# EAGLE schematic Guitutar (EAGLE 8.0.0)

## Sheet 1 of 2
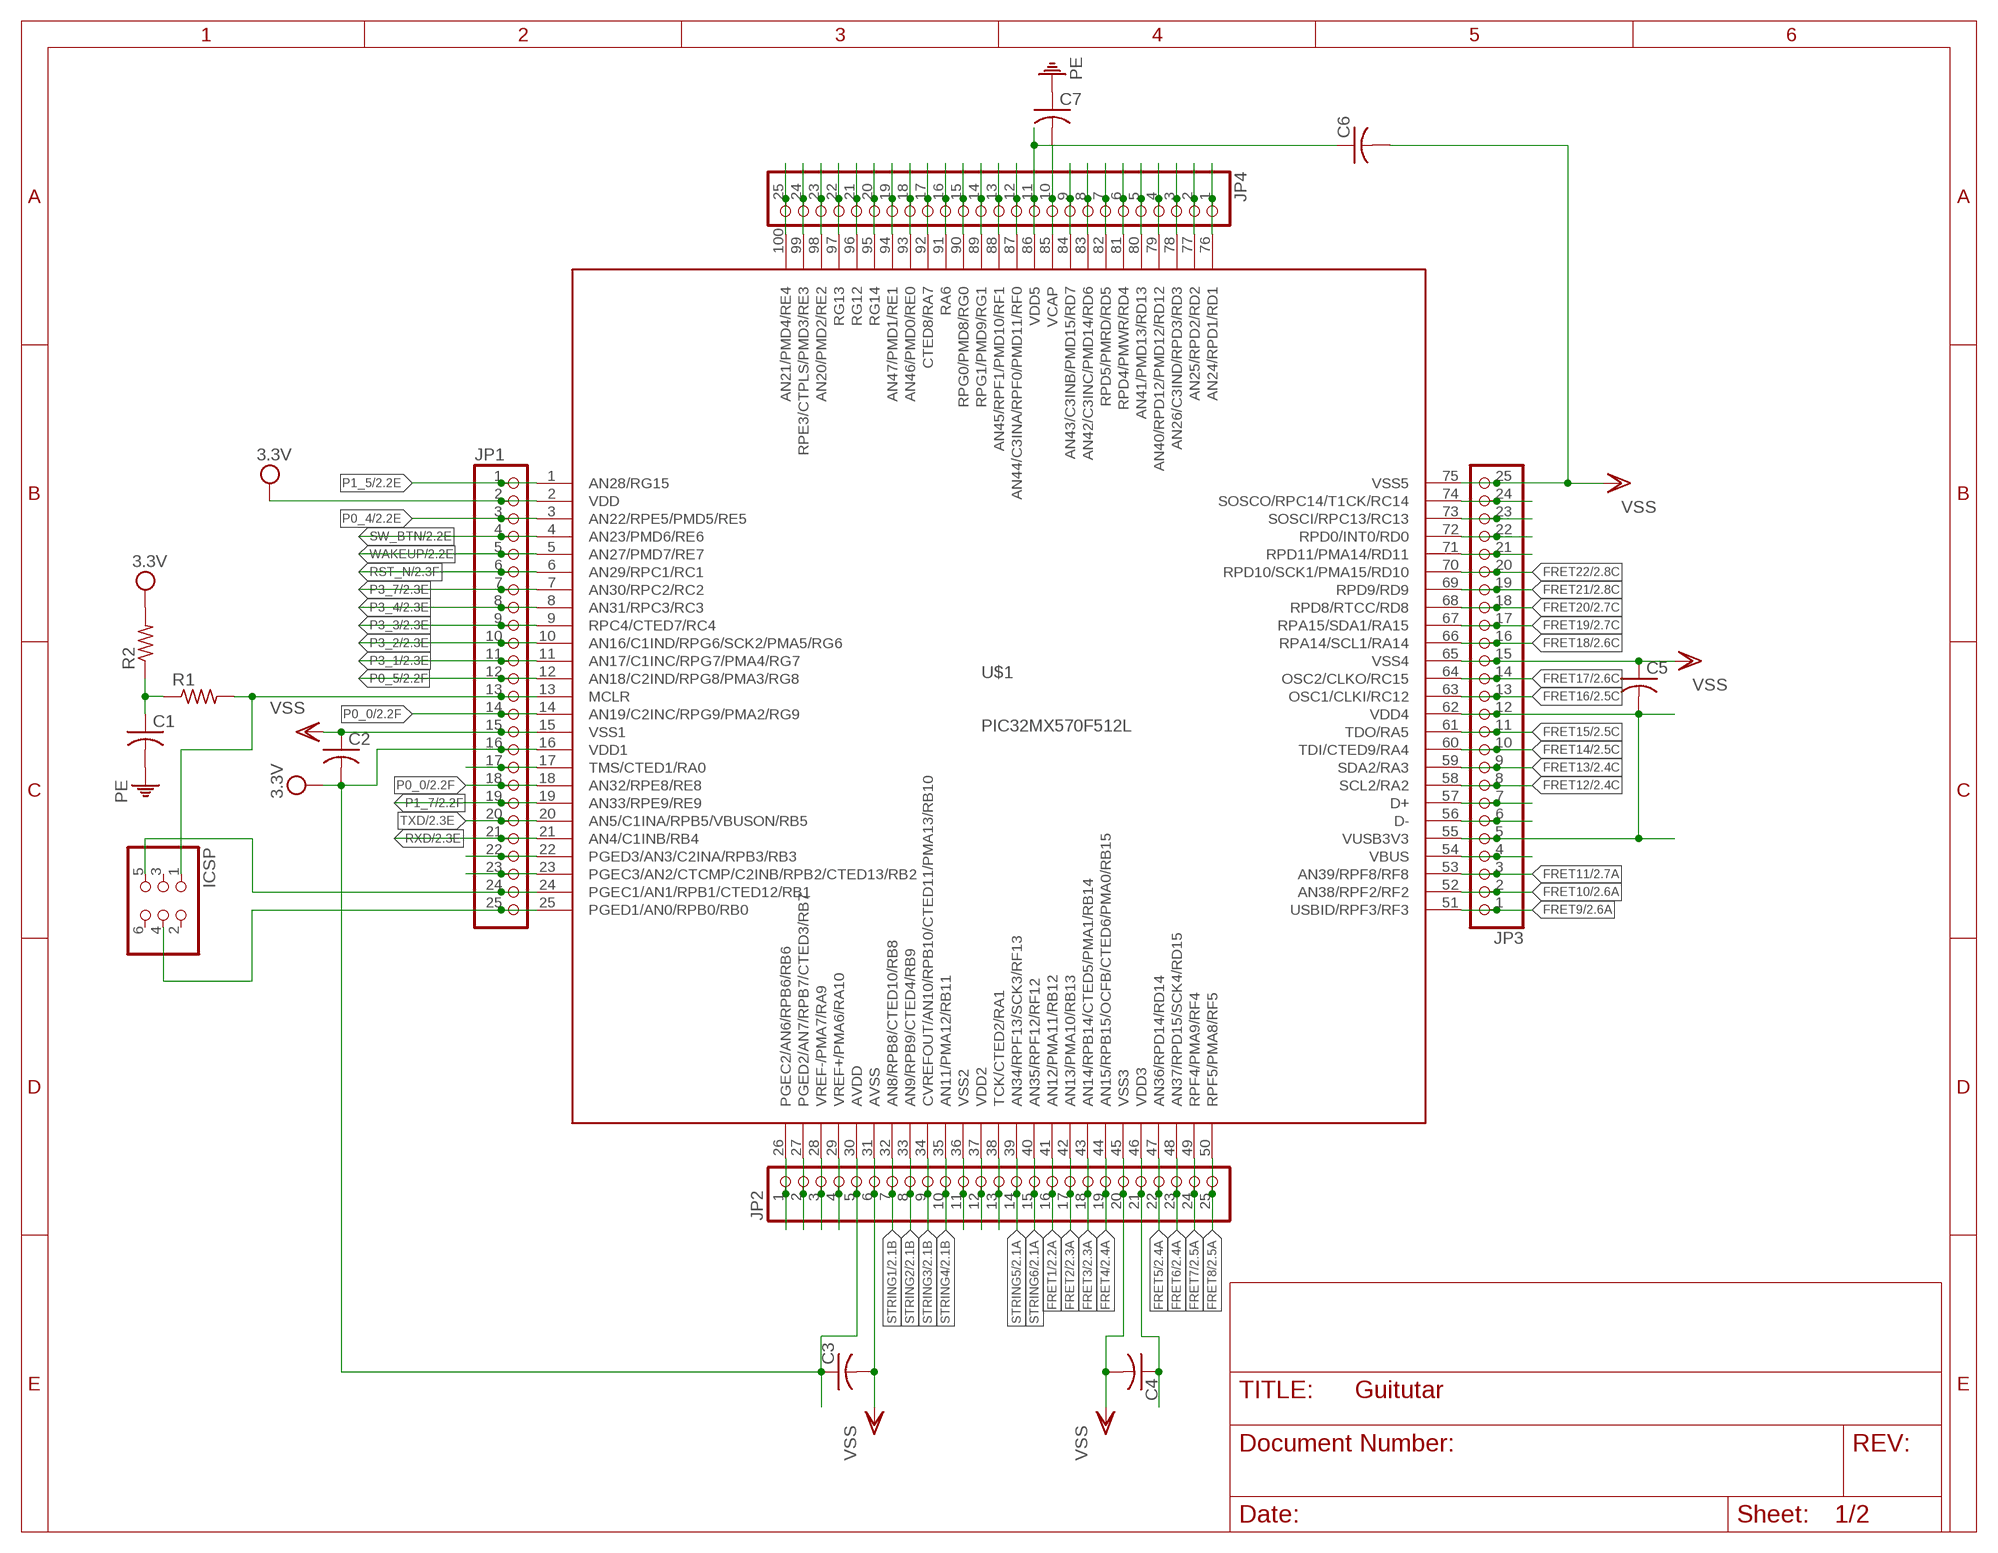
[diagram p0: schematic, sheet 1]

### Parts
C1  C-USC0805  [C0805]
C2  C-USC0805  [C0805]
C3  C-USC0805  [C0805]
C4  C-USC0805  [C0805]
C5  C-USC0805  [C0805]
C6  C-USC0805  [C0805]
C7  C-USC0805  [C0805]
ICSP  PINHD-2X3  [2X03]
JP1  PINHD-1X25  [1X25]
JP2  PINHD-1X25  [1X25]
JP3  PINHD-1X25  [1X25]
JP4  PINHD-1X25  [1X25]
R1  R-US_M0805  [M0805]
R2  R-US_M0805  [M0805]
U$1  PIC32MX570F512L  [TQFP100-14X14]

### Nets
FRET1: JP2.16 U$1.41(AN12/PMA11/RB12) ; also sheet 2
FRET2: JP2.17 U$1.42(AN13/PMA10/RB13) ; also sheet 2
FRET3: JP2.18 U$1.43(AN14/RPB14/CTED5/PMA1/RB14) ; also sheet 2
FRET4: JP2.19 U$1.44(AN15/RPB15/OCFB/CTED6/PMA0/RB15) ; also sheet 2
FRET5: JP2.22 U$1.47(AN36/RPD14/RD14) ; also sheet 2
FRET6: JP2.23 U$1.48(AN37/RPD15/SCK4/RD15) ; also sheet 2
FRET7: JP2.24 U$1.49(RPF4/PMA9/RF4) ; also sheet 2
FRET8: JP2.25 U$1.50(RPF5/PMA8/RF5) ; also sheet 2
FRET9: JP3.1 U$1.51(USBID/RPF3/RF3) ; also sheet 2
FRET10: JP3.2 U$1.52(AN38/RPF2/RF2) ; also sheet 2
FRET11: JP3.3 U$1.53(AN39/RPF8/RF8) ; also sheet 2
FRET12: JP3.8 U$1.58(SCL2/RA2) ; also sheet 2
FRET13: JP3.9 U$1.59(SDA2/RA3) ; also sheet 2
FRET14: JP3.10 U$1.60(TDI/CTED9/RA4) ; also sheet 2
FRET15: JP3.11 U$1.61(TDO/RA5) ; also sheet 2
FRET16: JP3.13 U$1.63(OSC1/CLKI/RC12) ; also sheet 2
FRET17: JP3.14 U$1.64(OSC2/CLKO/RC15) ; also sheet 2
FRET18: JP3.16 U$1.66(RPA14/SCL1/RA14) ; also sheet 2
FRET19: JP3.17 U$1.67(RPA15/SDA1/RA15) ; also sheet 2
FRET20: JP3.18 U$1.68(RPD8/RTCC/RD8) ; also sheet 2
FRET21: JP3.19 U$1.69(RPD9/RD9) ; also sheet 2
FRET22: JP3.20 U$1.70(RPD10/SCK1/PMA15/RD10) ; also sheet 2
N$1: C1.1 R1.1 R2.1
N$2: ICSP.5 JP1.24 U$1.24(PGEC1/AN1/RPB1/CTED12/RB1)
N$3: JP1.17 U$1.17(TMS/CTED1/RA0)
N$4: JP1.22 U$1.22(PGED3/AN3/C2INA/RPB3/RB3)
N$5: JP1.23 U$1.23(PGEC3/AN2/CTCMP/C2INB/RPB2/CTED13/RB2)
N$7: C4.1 JP2.21 U$1.46(VDD3)
N$9: C5.2 JP3.5 JP3.12 U$1.55(VUSB3V3) U$1.62(VDD4)
N$10: C6.1 JP4.11 U$1.86(VDD5)
N$12: C7.2 JP4.10 U$1.85(VCAP)
N$13: ICSP.1 JP1.13 R1.2 U$1.13(MCLR)
N$14: ICSP.4 JP1.25 U$1.25(PGED1/AN0/RPB0/RB0)
N$42: JP2.1 U$1.26(PGEC2/AN6/RPB6/RB6)
N$43: JP2.2 U$1.27(PGED2/AN7/RPB7/CTED3/RB7)
N$44: JP2.3 U$1.28(VREF-/PMA7/RA9)
N$45: JP2.4 U$1.29(VREF+/PMA6/RA10)
N$50: JP2.11 U$1.36(VSS2)
N$51: JP2.12 U$1.37(VDD2)
N$52: JP2.13 U$1.38(TCK/CTED2/RA1)
N$66: JP3.4 U$1.54(VBUS)
N$67: JP3.6 U$1.56(D-)
N$68: JP3.7 U$1.57(D+)
N$80: JP3.21 U$1.71(RPD11/PMA14/RD11)
N$81: JP3.22 U$1.72(RPD0/INT0/RD0)
N$82: JP3.23 U$1.73(SOSCI/RPC13/RC13)
N$83: JP3.24 U$1.74(SOSCO/RPC14/T1CK/RC14)
N$84: JP4.1 U$1.76(AN24/RPD1/RD1)
N$85: JP4.2 U$1.77(AN25/RPD2/RD2)
N$86: JP4.3 U$1.78(AN26/C3IND/RPD3/RD3)
N$87: JP4.4 U$1.79(AN40/RPD12/PMD12/RD12)
N$88: JP4.5 U$1.80(AN41/PMD13/RD13)
N$89: JP4.6 U$1.81(RPD4/PMWR/RD4)
N$90: JP4.7 U$1.82(RPD5/PMRD/RD5)
N$91: JP4.8 U$1.83(AN42/C3INC/PMD14/RD6)
N$92: JP4.9 U$1.84(AN43/C3INB/PMD15/RD7)
N$93: JP4.12 U$1.87(AN44/C3INA/RPF0/PMD11/RF0)
N$94: JP4.13 U$1.88(AN45/RPF1/PMD10/RF1)
N$95: JP4.14 U$1.89(RPG1/PMD9/RG1)
N$96: JP4.15 U$1.90(RPG0/PMD8/RG0)
N$97: JP4.16 U$1.91(RA6)
N$98: JP4.17 U$1.92(CTED8/RA7)
N$99: JP4.18 U$1.93(AN46/PMD0/RE0)
N$100: JP4.19 U$1.94(AN47/PMD1/RE1)
N$101: JP4.20 U$1.95(RG14)
N$102: JP4.21 U$1.96(RG12)
N$103: JP4.22 U$1.97(RG13)
N$104: JP4.23 U$1.98(AN20/PMD2/RE2)
N$105: JP4.24 U$1.99(RPE3/CTPLS/PMD3/RE3)
N$106: JP4.25 U$1.100(AN21/PMD4/RE4)
P0_0: JP1.14 JP1.18 U$1.14(AN19/C2INC/RPG9/PMA2/RG9) U$1.18(AN32/RPE8/RE8) ; also sheet 2
P0_4: JP1.3 U$1.3(AN22/RPE5/PMD5/RE5) ; also sheet 2
P0_5: JP1.12 U$1.12(AN18/C2IND/RPG8/PMA3/RG8) ; also sheet 2
P1_5: JP1.1 U$1.1(AN28/RG15) ; also sheet 2
P1_7: JP1.19 U$1.19(AN33/RPE9/RE9) ; also sheet 2
P3_1: JP1.11 U$1.11(AN17/C1INC/RPG7/PMA4/RG7) ; also sheet 2
P3_2: JP1.10 U$1.10(AN16/C1IND/RPG6/SCK2/PMA5/RG6) ; also sheet 2
P3_3: JP1.9 U$1.9(RPC4/CTED7/RC4) ; also sheet 2
P3_4: JP1.8 U$1.8(AN31/RPC3/RC3) ; also sheet 2
P3_7: JP1.7 U$1.7(AN30/RPC2/RC2) ; also sheet 2
PE: C1.2 C7.1 ; also sheet 2
RST_N: JP1.6 U$1.6(AN29/RPC1/RC1) ; also sheet 2
RXD: JP1.21 U$1.21(AN4/C1INB/RB4) ; also sheet 2
STRING1: JP2.7 U$1.32(AN8/RPB8/CTED10/RB8) ; also sheet 2
STRING2: JP2.8 U$1.33(AN9/RPB9/CTED4/RB9) ; also sheet 2
STRING3: JP2.9 U$1.34(CVREFOUT/AN10/RPB10/CTED11/PMA13/RB10) ; also sheet 2
STRING4: JP2.10 U$1.35(AN11/PMA12/RB11) ; also sheet 2
STRING5: JP2.14 U$1.39(AN34/RPF13/SCK3/RF13) ; also sheet 2
STRING6: JP2.15 U$1.40(AN35/RPF12/RF12) ; also sheet 2
SW_BTN: JP1.4 U$1.4(AN23/PMD6/RE6) ; also sheet 2
TXD: JP1.20 U$1.20(AN5/C1INA/RPB5/VBUSON/RB5) ; also sheet 2
VDD: C2.2 C3.1 JP1.2 JP1.16 JP2.5 R2.2 U$1.2(VDD) U$1.16(VDD1) U$1.30(AVDD) ; supply symbol labelled 3.3V ; also sheet 2
VSS: C2.1 C3.2 C4.2 C5.1 C6.2 JP1.15 JP2.6 JP2.20 JP3.15 JP3.25 U$1.15(VSS1) U$1.31(AVSS) U$1.45(VSS3) U$1.65(VSS4) U$1.75(VSS5)
WAKEUP: JP1.5 U$1.5(AN27/PMD7/RE7) ; also sheet 2
Unconnected: ICSP.2 ICSP.3 ICSP.6

## Sheet 2 of 2
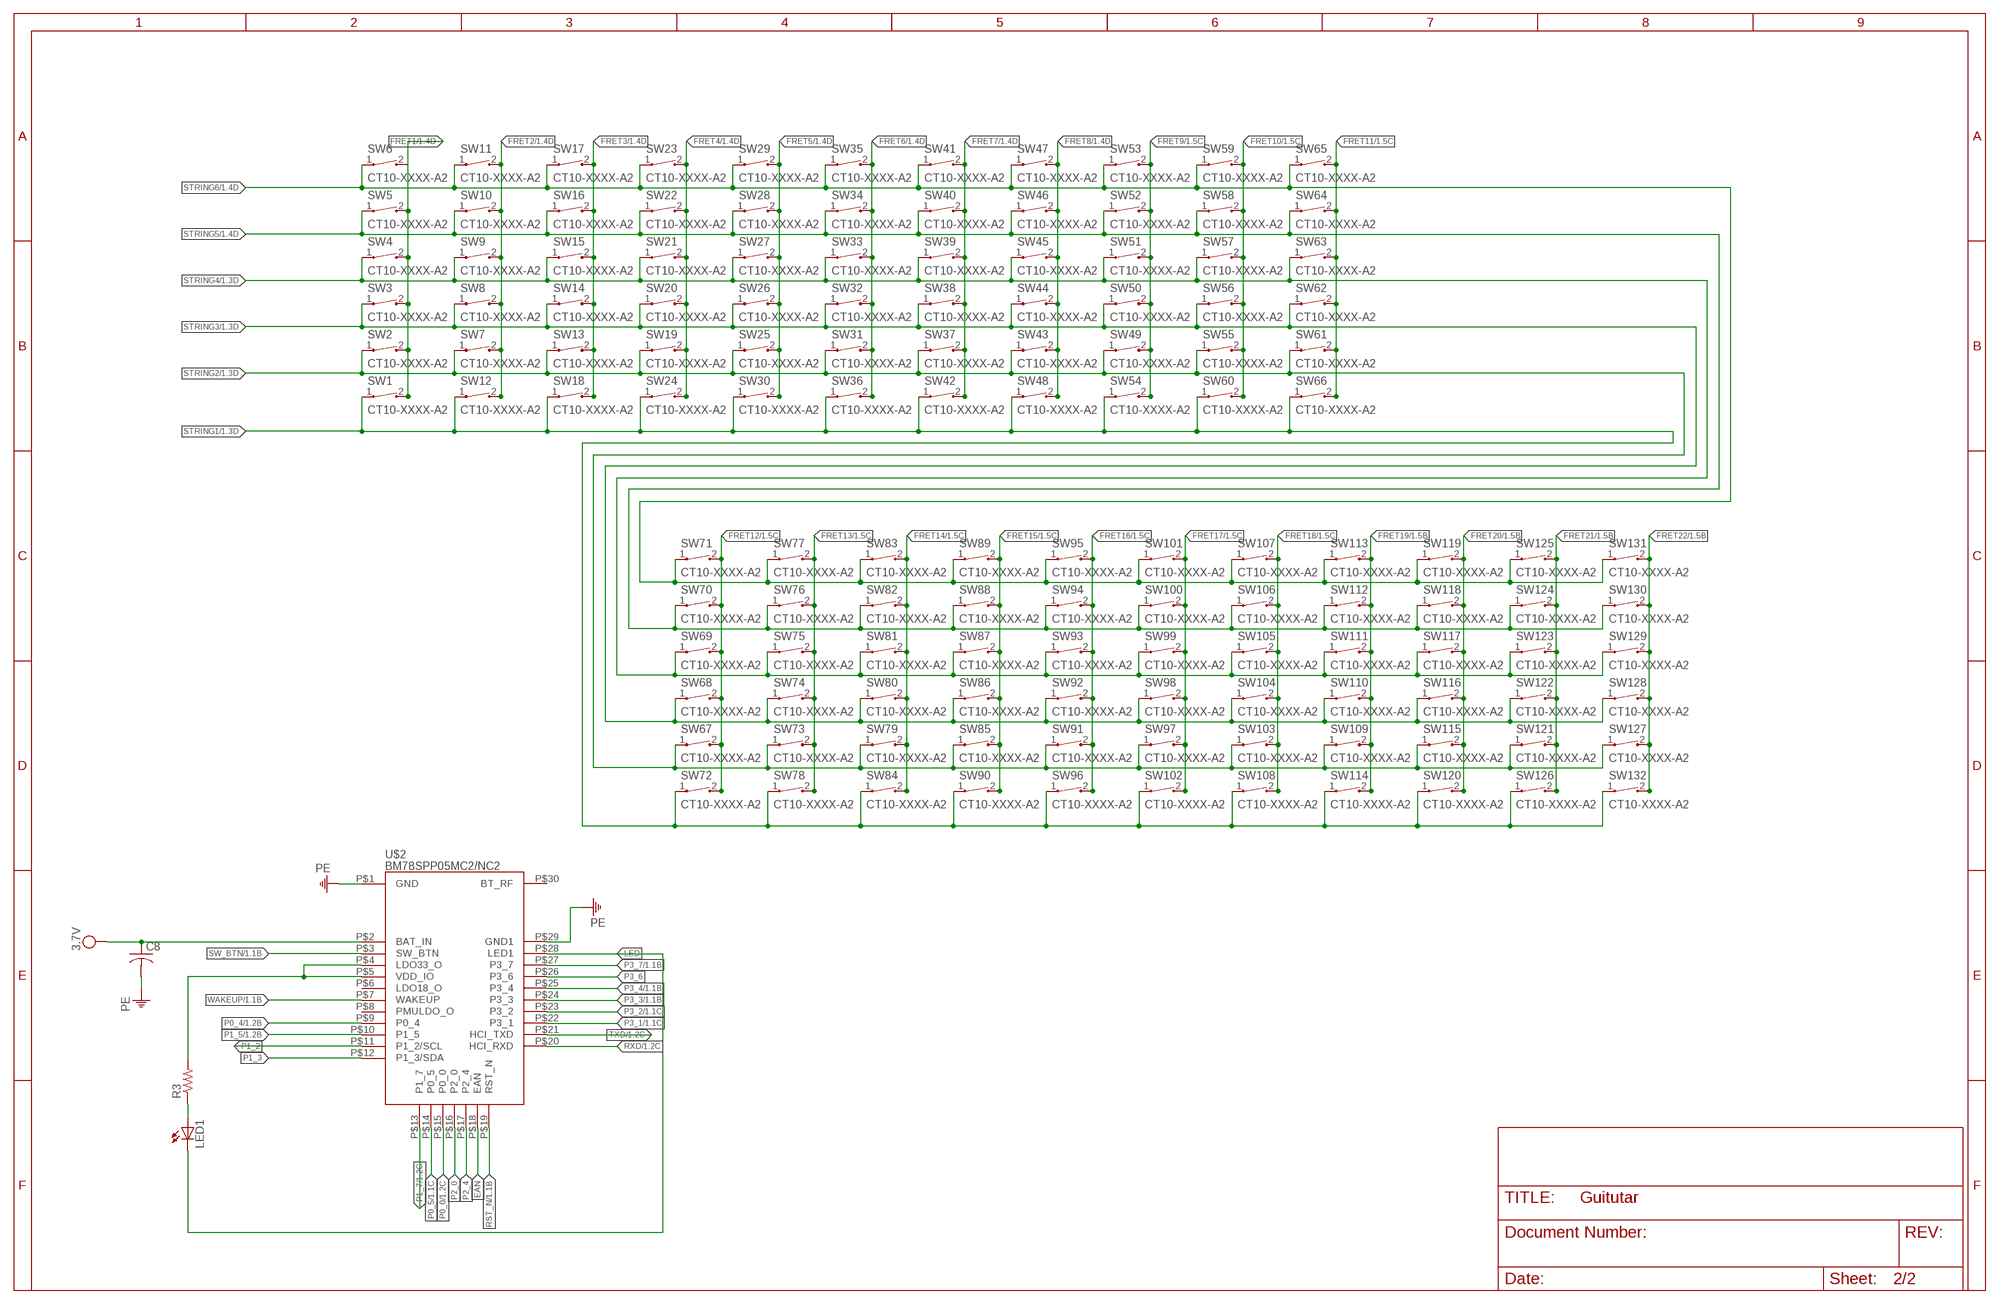
[diagram p1: schematic, sheet 2]

### Parts
C8  C-USC0805  [C0805]
LED1  LEDSMT1206  [1206]
R3  R-US_M0805  [M0805]
SW1  CT10-XXXX-A2  [CT10-XXXX-A2]
SW2  CT10-XXXX-A2  [CT10-XXXX-A2]
SW3  CT10-XXXX-A2  [CT10-XXXX-A2]
SW4  CT10-XXXX-A2  [CT10-XXXX-A2]
SW5  CT10-XXXX-A2  [CT10-XXXX-A2]
SW6  CT10-XXXX-A2  [CT10-XXXX-A2]
SW7  CT10-XXXX-A2  [CT10-XXXX-A2]
SW8  CT10-XXXX-A2  [CT10-XXXX-A2]
SW9  CT10-XXXX-A2  [CT10-XXXX-A2]
SW10  CT10-XXXX-A2  [CT10-XXXX-A2]
SW11  CT10-XXXX-A2  [CT10-XXXX-A2]
SW12  CT10-XXXX-A2  [CT10-XXXX-A2]
SW13  CT10-XXXX-A2  [CT10-XXXX-A2]
SW14  CT10-XXXX-A2  [CT10-XXXX-A2]
SW15  CT10-XXXX-A2  [CT10-XXXX-A2]
SW16  CT10-XXXX-A2  [CT10-XXXX-A2]
SW17  CT10-XXXX-A2  [CT10-XXXX-A2]
SW18  CT10-XXXX-A2  [CT10-XXXX-A2]
SW19  CT10-XXXX-A2  [CT10-XXXX-A2]
SW20  CT10-XXXX-A2  [CT10-XXXX-A2]
SW21  CT10-XXXX-A2  [CT10-XXXX-A2]
SW22  CT10-XXXX-A2  [CT10-XXXX-A2]
SW23  CT10-XXXX-A2  [CT10-XXXX-A2]
SW24  CT10-XXXX-A2  [CT10-XXXX-A2]
SW25  CT10-XXXX-A2  [CT10-XXXX-A2]
SW26  CT10-XXXX-A2  [CT10-XXXX-A2]
SW27  CT10-XXXX-A2  [CT10-XXXX-A2]
SW28  CT10-XXXX-A2  [CT10-XXXX-A2]
SW29  CT10-XXXX-A2  [CT10-XXXX-A2]
SW30  CT10-XXXX-A2  [CT10-XXXX-A2]
SW31  CT10-XXXX-A2  [CT10-XXXX-A2]
SW32  CT10-XXXX-A2  [CT10-XXXX-A2]
SW33  CT10-XXXX-A2  [CT10-XXXX-A2]
SW34  CT10-XXXX-A2  [CT10-XXXX-A2]
SW35  CT10-XXXX-A2  [CT10-XXXX-A2]
SW36  CT10-XXXX-A2  [CT10-XXXX-A2]
SW37  CT10-XXXX-A2  [CT10-XXXX-A2]
SW38  CT10-XXXX-A2  [CT10-XXXX-A2]
SW39  CT10-XXXX-A2  [CT10-XXXX-A2]
SW40  CT10-XXXX-A2  [CT10-XXXX-A2]
SW41  CT10-XXXX-A2  [CT10-XXXX-A2]
SW42  CT10-XXXX-A2  [CT10-XXXX-A2]
SW43  CT10-XXXX-A2  [CT10-XXXX-A2]
SW44  CT10-XXXX-A2  [CT10-XXXX-A2]
SW45  CT10-XXXX-A2  [CT10-XXXX-A2]
SW46  CT10-XXXX-A2  [CT10-XXXX-A2]
SW47  CT10-XXXX-A2  [CT10-XXXX-A2]
SW48  CT10-XXXX-A2  [CT10-XXXX-A2]
SW49  CT10-XXXX-A2  [CT10-XXXX-A2]
SW50  CT10-XXXX-A2  [CT10-XXXX-A2]
SW51  CT10-XXXX-A2  [CT10-XXXX-A2]
SW52  CT10-XXXX-A2  [CT10-XXXX-A2]
SW53  CT10-XXXX-A2  [CT10-XXXX-A2]
SW54  CT10-XXXX-A2  [CT10-XXXX-A2]
SW55  CT10-XXXX-A2  [CT10-XXXX-A2]
SW56  CT10-XXXX-A2  [CT10-XXXX-A2]
SW57  CT10-XXXX-A2  [CT10-XXXX-A2]
SW58  CT10-XXXX-A2  [CT10-XXXX-A2]
SW59  CT10-XXXX-A2  [CT10-XXXX-A2]
SW60  CT10-XXXX-A2  [CT10-XXXX-A2]
SW61  CT10-XXXX-A2  [CT10-XXXX-A2]
SW62  CT10-XXXX-A2  [CT10-XXXX-A2]
SW63  CT10-XXXX-A2  [CT10-XXXX-A2]
SW64  CT10-XXXX-A2  [CT10-XXXX-A2]
SW65  CT10-XXXX-A2  [CT10-XXXX-A2]
SW66  CT10-XXXX-A2  [CT10-XXXX-A2]
SW67  CT10-XXXX-A2  [CT10-XXXX-A2]
SW68  CT10-XXXX-A2  [CT10-XXXX-A2]
SW69  CT10-XXXX-A2  [CT10-XXXX-A2]
SW70  CT10-XXXX-A2  [CT10-XXXX-A2]
SW71  CT10-XXXX-A2  [CT10-XXXX-A2]
SW72  CT10-XXXX-A2  [CT10-XXXX-A2]
SW73  CT10-XXXX-A2  [CT10-XXXX-A2]
SW74  CT10-XXXX-A2  [CT10-XXXX-A2]
SW75  CT10-XXXX-A2  [CT10-XXXX-A2]
SW76  CT10-XXXX-A2  [CT10-XXXX-A2]
SW77  CT10-XXXX-A2  [CT10-XXXX-A2]
SW78  CT10-XXXX-A2  [CT10-XXXX-A2]
SW79  CT10-XXXX-A2  [CT10-XXXX-A2]
SW80  CT10-XXXX-A2  [CT10-XXXX-A2]
SW81  CT10-XXXX-A2  [CT10-XXXX-A2]
SW82  CT10-XXXX-A2  [CT10-XXXX-A2]
SW83  CT10-XXXX-A2  [CT10-XXXX-A2]
SW84  CT10-XXXX-A2  [CT10-XXXX-A2]
SW85  CT10-XXXX-A2  [CT10-XXXX-A2]
SW86  CT10-XXXX-A2  [CT10-XXXX-A2]
SW87  CT10-XXXX-A2  [CT10-XXXX-A2]
SW88  CT10-XXXX-A2  [CT10-XXXX-A2]
SW89  CT10-XXXX-A2  [CT10-XXXX-A2]
SW90  CT10-XXXX-A2  [CT10-XXXX-A2]
SW91  CT10-XXXX-A2  [CT10-XXXX-A2]
SW92  CT10-XXXX-A2  [CT10-XXXX-A2]
SW93  CT10-XXXX-A2  [CT10-XXXX-A2]
SW94  CT10-XXXX-A2  [CT10-XXXX-A2]
SW95  CT10-XXXX-A2  [CT10-XXXX-A2]
SW96  CT10-XXXX-A2  [CT10-XXXX-A2]
SW97  CT10-XXXX-A2  [CT10-XXXX-A2]
SW98  CT10-XXXX-A2  [CT10-XXXX-A2]
SW99  CT10-XXXX-A2  [CT10-XXXX-A2]
SW100  CT10-XXXX-A2  [CT10-XXXX-A2]
SW101  CT10-XXXX-A2  [CT10-XXXX-A2]
SW102  CT10-XXXX-A2  [CT10-XXXX-A2]
SW103  CT10-XXXX-A2  [CT10-XXXX-A2]
SW104  CT10-XXXX-A2  [CT10-XXXX-A2]
SW105  CT10-XXXX-A2  [CT10-XXXX-A2]
SW106  CT10-XXXX-A2  [CT10-XXXX-A2]
SW107  CT10-XXXX-A2  [CT10-XXXX-A2]
SW108  CT10-XXXX-A2  [CT10-XXXX-A2]
SW109  CT10-XXXX-A2  [CT10-XXXX-A2]
SW110  CT10-XXXX-A2  [CT10-XXXX-A2]
SW111  CT10-XXXX-A2  [CT10-XXXX-A2]
SW112  CT10-XXXX-A2  [CT10-XXXX-A2]
SW113  CT10-XXXX-A2  [CT10-XXXX-A2]
SW114  CT10-XXXX-A2  [CT10-XXXX-A2]
SW115  CT10-XXXX-A2  [CT10-XXXX-A2]
SW116  CT10-XXXX-A2  [CT10-XXXX-A2]
SW117  CT10-XXXX-A2  [CT10-XXXX-A2]
SW118  CT10-XXXX-A2  [CT10-XXXX-A2]
SW119  CT10-XXXX-A2  [CT10-XXXX-A2]
SW120  CT10-XXXX-A2  [CT10-XXXX-A2]
SW121  CT10-XXXX-A2  [CT10-XXXX-A2]
SW122  CT10-XXXX-A2  [CT10-XXXX-A2]
SW123  CT10-XXXX-A2  [CT10-XXXX-A2]
SW124  CT10-XXXX-A2  [CT10-XXXX-A2]
SW125  CT10-XXXX-A2  [CT10-XXXX-A2]
SW126  CT10-XXXX-A2  [CT10-XXXX-A2]
SW127  CT10-XXXX-A2  [CT10-XXXX-A2]
SW128  CT10-XXXX-A2  [CT10-XXXX-A2]
SW129  CT10-XXXX-A2  [CT10-XXXX-A2]
SW130  CT10-XXXX-A2  [CT10-XXXX-A2]
SW131  CT10-XXXX-A2  [CT10-XXXX-A2]
SW132  CT10-XXXX-A2  [CT10-XXXX-A2]
U$2  BM78SPP05MC2/NC2  [BM78SPP05MC2/NC2]

### Nets
EAN: U$2.P$18(EAN)
FRET1: SW1.2 SW2.2 SW3.2 SW4.2 SW5.2 SW6.2 ; also sheet 1
FRET2: SW7.2 SW8.2 SW9.2 SW10.2 SW11.2 SW12.2 ; also sheet 1
FRET3: SW13.2 SW14.2 SW15.2 SW16.2 SW17.2 SW18.2 ; also sheet 1
FRET4: SW19.2 SW20.2 SW21.2 SW22.2 SW23.2 SW24.2 ; also sheet 1
FRET5: SW25.2 SW26.2 SW27.2 SW28.2 SW29.2 SW30.2 ; also sheet 1
FRET6: SW31.2 SW32.2 SW33.2 SW34.2 SW35.2 SW36.2 ; also sheet 1
FRET7: SW37.2 SW38.2 SW39.2 SW40.2 SW41.2 SW42.2 ; also sheet 1
FRET8: SW43.2 SW44.2 SW45.2 SW46.2 SW47.2 SW48.2 ; also sheet 1
FRET9: SW49.2 SW50.2 SW51.2 SW52.2 SW53.2 SW54.2 ; also sheet 1
FRET10: SW55.2 SW56.2 SW57.2 SW58.2 SW59.2 SW60.2 ; also sheet 1
FRET11: SW61.2 SW62.2 SW63.2 SW64.2 SW65.2 SW66.2 ; also sheet 1
FRET12: SW67.2 SW68.2 SW69.2 SW70.2 SW71.2 SW72.2 ; also sheet 1
FRET13: SW73.2 SW74.2 SW75.2 SW76.2 SW77.2 SW78.2 ; also sheet 1
FRET14: SW79.2 SW80.2 SW81.2 SW82.2 SW83.2 SW84.2 ; also sheet 1
FRET15: SW85.2 SW86.2 SW87.2 SW88.2 SW89.2 SW90.2 ; also sheet 1
FRET16: SW91.2 SW92.2 SW93.2 SW94.2 SW95.2 SW96.2 ; also sheet 1
FRET17: SW97.2 SW98.2 SW99.2 SW100.2 SW101.2 SW102.2 ; also sheet 1
FRET18: SW103.2 SW104.2 SW105.2 SW106.2 SW107.2 SW108.2 ; also sheet 1
FRET19: SW109.2 SW110.2 SW111.2 SW112.2 SW113.2 SW114.2 ; also sheet 1
FRET20: SW115.2 SW116.2 SW117.2 SW118.2 SW119.2 SW120.2 ; also sheet 1
FRET21: SW121.2 SW122.2 SW123.2 SW124.2 SW125.2 SW126.2 ; also sheet 1
FRET22: SW127.2 SW128.2 SW129.2 SW130.2 SW131.2 SW132.2 ; also sheet 1
LED: LED1.C U$2.P$28(LED1)
N$15: LED1.A R3.1
N$16: R3.2 U$2.P$4(LDO33_O) U$2.P$5(VDD_IO)
P0_0: U$2.P$15(P0_0) ; also sheet 1
P0_4: U$2.P$9(P0_4) ; also sheet 1
P0_5: U$2.P$14(P0_5) ; also sheet 1
P1_2: U$2.P$11(P1_2/SCL)
P1_3: U$2.P$12(P1_3/SDA)
P1_5: U$2.P$10(P1_5) ; also sheet 1
P1_7: U$2.P$13(P1_7) ; also sheet 1
P2_0: U$2.P$16(P2_0)
P2_4: U$2.P$17(P2_4)
P3_1: U$2.P$22(P3_1) ; also sheet 1
P3_2: U$2.P$23(P3_2) ; also sheet 1
P3_3: U$2.P$24(P3_3) ; also sheet 1
P3_4: U$2.P$25(P3_4) ; also sheet 1
P3_6: U$2.P$26(P3_6)
P3_7: U$2.P$27(P3_7) ; also sheet 1
PE: C8.2 U$2.P$1(GND) U$2.P$29(GND1) ; also sheet 1
RST_N: U$2.P$19(RST_N) ; also sheet 1
RXD: U$2.P$20(HCI_RXD) ; also sheet 1
STRING1: SW1.1 SW12.1 SW18.1 SW24.1 SW30.1 SW36.1 SW42.1 SW48.1 SW54.1 SW60.1 SW66.1 SW72.1 SW78.1 SW84.1 SW90.1 SW96.1 SW102.1 SW108.1 SW114.1 SW120.1 SW126.1 SW132.1 ; also sheet 1
STRING2: SW2.1 SW7.1 SW13.1 SW19.1 SW25.1 SW31.1 SW37.1 SW43.1 SW49.1 SW55.1 SW61.1 SW67.1 SW73.1 SW79.1 SW85.1 SW91.1 SW97.1 SW103.1 SW109.1 SW115.1 SW121.1 SW127.1 ; also sheet 1
STRING3: SW3.1 SW8.1 SW14.1 SW20.1 SW26.1 SW32.1 SW38.1 SW44.1 SW50.1 SW56.1 SW62.1 SW68.1 SW74.1 SW80.1 SW86.1 SW92.1 SW98.1 SW104.1 SW110.1 SW116.1 SW122.1 SW128.1 ; also sheet 1
STRING4: SW4.1 SW9.1 SW15.1 SW21.1 SW27.1 SW33.1 SW39.1 SW45.1 SW51.1 SW57.1 SW63.1 SW69.1 SW75.1 SW81.1 SW87.1 SW93.1 SW99.1 SW105.1 SW111.1 SW117.1 SW123.1 SW129.1 ; also sheet 1
STRING5: SW5.1 SW10.1 SW16.1 SW22.1 SW28.1 SW34.1 SW40.1 SW46.1 SW52.1 SW58.1 SW64.1 SW70.1 SW76.1 SW82.1 SW88.1 SW94.1 SW100.1 SW106.1 SW112.1 SW118.1 SW124.1 SW130.1 ; also sheet 1
STRING6: SW6.1 SW11.1 SW17.1 SW23.1 SW29.1 SW35.1 SW41.1 SW47.1 SW53.1 SW59.1 SW65.1 SW71.1 SW77.1 SW83.1 SW89.1 SW95.1 SW101.1 SW107.1 SW113.1 SW119.1 SW125.1 SW131.1 ; also sheet 1
SW_BTN: U$2.P$3(SW_BTN) ; also sheet 1
TXD: U$2.P$21(HCI_TXD) ; also sheet 1
VDD: C8.1 U$2.P$2(BAT_IN) ; supply symbol labelled 3.7V ; also sheet 1
WAKEUP: U$2.P$7(WAKEUP) ; also sheet 1
Unconnected: U$2.P$6(LDO18_O) U$2.P$8(PMULDO_O) U$2.P$30(BT_RF)

## Library data of the parts
C1-C8 = rcl:C-US: CAPACITOR, American symbol
ICSP = pinhead:PINHD-2X3: PIN HEADER
JP1-JP4 = pinhead:PINHD-1X25: PIN HEADER
LED1 = led:LED: LED OSRAM: - CHIPLED LG R971, LG N971, LY N971, LG Q971, LY Q971, LO R971, LY R971 LH N974, LH R974 LS Q976, LO Q976, LY Q976 LO Q996 - Hyper CHIPLED LW Q18S LB Q993, LB Q99A, LB R99A - SideLED LS A670, LO A670, LY A670, LG A670, LP A670 LB A673, LV A673, LT A673, LW A673 LH A674 LY A675 LS A676, LA A676, LO A676, LY A676, LW A676 LS A679, LY A679, LG A679 - Hyper Micro SIDELED® LS Y876, LA Y876, LO Y876, LY Y876 LT Y87S - SmartLED LW L88C, LW L88S LB L89C, LB L89S, LG L890 LS L89K, LO L89K, LY L89K LS L896, LA L896, LO L896, LY L896 - TOPLED LS T670, LO T670, LY T670, LG T670, LP T670 LSG T670, LSP T670, LSY T670, LOP T670, LYG T670 LG T671, LOG T671, LSG T671 LB T673, LV T673, LT T673, LW T673 LH T674 LS T676, LA T676, LO T676, LY T676, LB T676, LH T676, LSB T676, LW T676 LB T67C, LV T67C, LT T67C, LS T67K, LO T67K, LY T67K, LW E67C LS E67B, LA E67B, LO E67B, LY E67B, LB E67C, LV E67C, LT E67C LW T67C LS T679, LY T679, LG T679 LS T770, LO T770, LY T770, LG T770, LP T770 LB T773, LV T773, LT T773, LW T773 LH T774 LS E675, LA E675, LY E675, LS T675 LS T776, LA T776, LO T776, LY T776, LB T776 LHGB T686 LT T68C, LB T68C - Hyper Mini TOPLED® LB M676 - Mini TOPLED Santana® LG M470 LS M47K, LO M47K, LY M47K Source: http://www.osram.convergy.de LUXEON: - LUMILED® LXK2-PW12-R00, LXK2-PW12-S00, LXK2-PW14-U00, LXK2-PW14-V00 LXK2-PM12-R00, LXK2-PM12-S00, LXK2-PM14-U00 LXK2-PE12-Q00, LXK2-PE12-R00, LXK2-PE12-S00, LXK2-PE14-T00, LXK2-PE14-U00 LXK2-PB12-K00, LXK2-PB12-L00, LXK2-PB12-M00, LXK2-PB14-N00, LXK2-PB14-P00, LXK2-PB14-Q00 LXK2-PR12-L00, LXK2-PR12-M00, LXK2-PR14-Q00, LXK2-PR14-R00 LXK2-PD12-Q00, LXK2-PD12-R00, LXK2-PD12-S00 LXK2-PH12-R00, LXK2-PH12-S00 LXK2-PL12-P00, LXK2-PL12-Q00, LXK2-PL12-R00 Source: www.luxeon.com KINGBRIGHT: KA-3528ASYC Source: www.kingbright.com
R1-R3 = rcl:R-US_: RESISTOR, American symbol
SW1-SW132 = switch-coto:CT10-XXXX-: CT10 Series Molded Switch Source: www.cotorelay.com .. Coto_Technology__CT10-1530-G1.pdf
U$1 = PICMX5xx:PIC32MX570F512L
U$2 = ECE477_Guitutar:BM78SPP05MC2/NC2